# EAGLE design 536-counter-7seg (EAGLE 7.5.0)
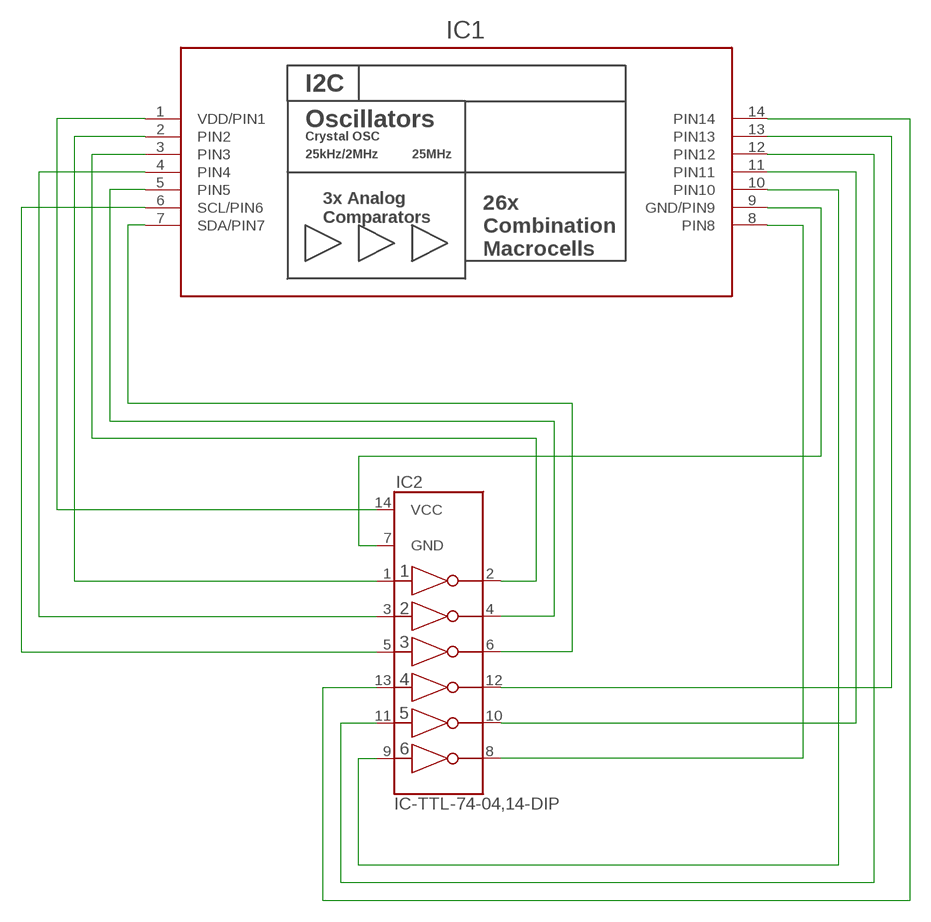
[diagram p0: schematic, sheet 1]

## Parts
IC1  SLG46536V  [STQFN14-0.4P2.0X2.2]
IC2  IC-TTL-74-04,14-DIP  [IC-SOCKET-DIL-14]

## Nets
GND: IC1.9(GND/PIN9) IC2.7(GND)
N$1: IC1.1(VDD/PIN1) IC2.14(VCC)
N$3: IC1.2(PIN2) IC2.1(1A)
N$4: IC1.3(PIN3) IC2.2(1Y)
N$5: IC1.4(PIN4) IC2.3(2A)
N$6: IC1.5(PIN5) IC2.4(2Y)
N$7: IC1.6(SCL/PIN6) IC2.5(3A)
N$8: IC1.7(SDA/PIN7) IC2.6(3Y)
N$9: IC1.8(PIN8) IC2.8(6Y)
N$10: IC1.10(PIN10) IC2.9(6A)
N$11: IC1.11(PIN11) IC2.10(5Y)
N$12: IC1.12(PIN12) IC2.11(5A)
N$13: IC1.13(PIN13) IC2.12(4Y)
N$14: IC1.14(PIN14) IC2.13(4A)

## Library data of the parts
IC1 = mylib:SLG46536
IC2 = mylib:IC-TTL-74-04,14: IC-TTL-74-04,14 : HEX INVERTER Packages : -DIP : 2.54 x 14 x 300mil -FLAT : 1.27 x 14 x (Width) (Variant name3) : (Pitch) x (Pin) x (Width)

## Board
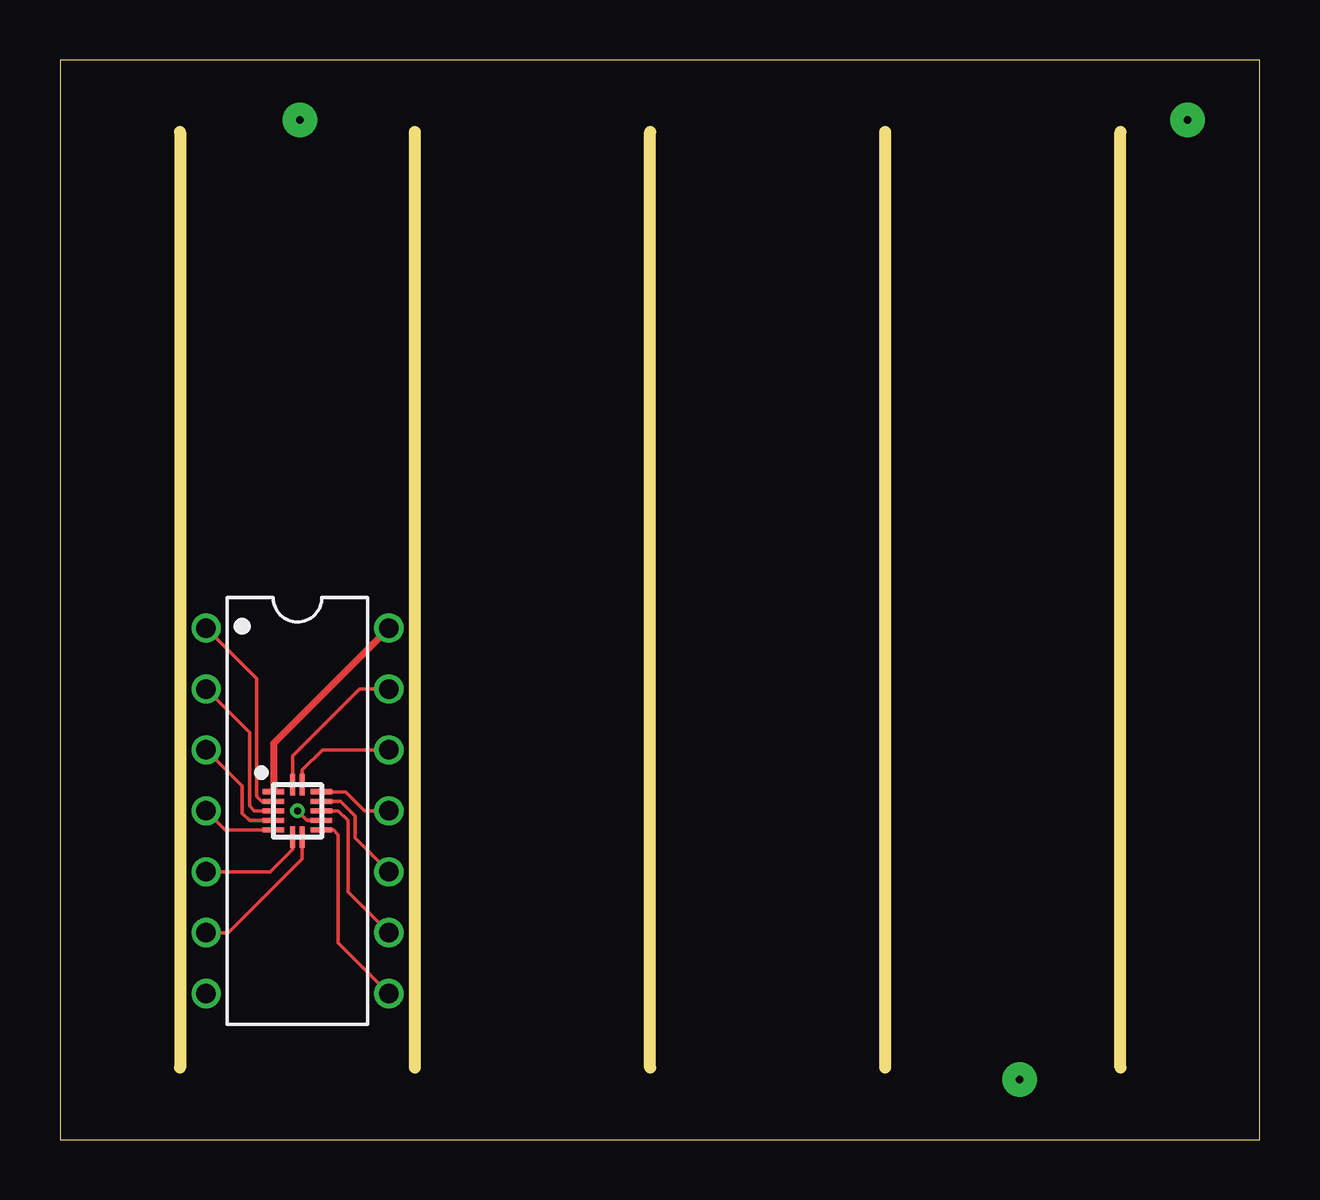
[diagram p1: board, top side]
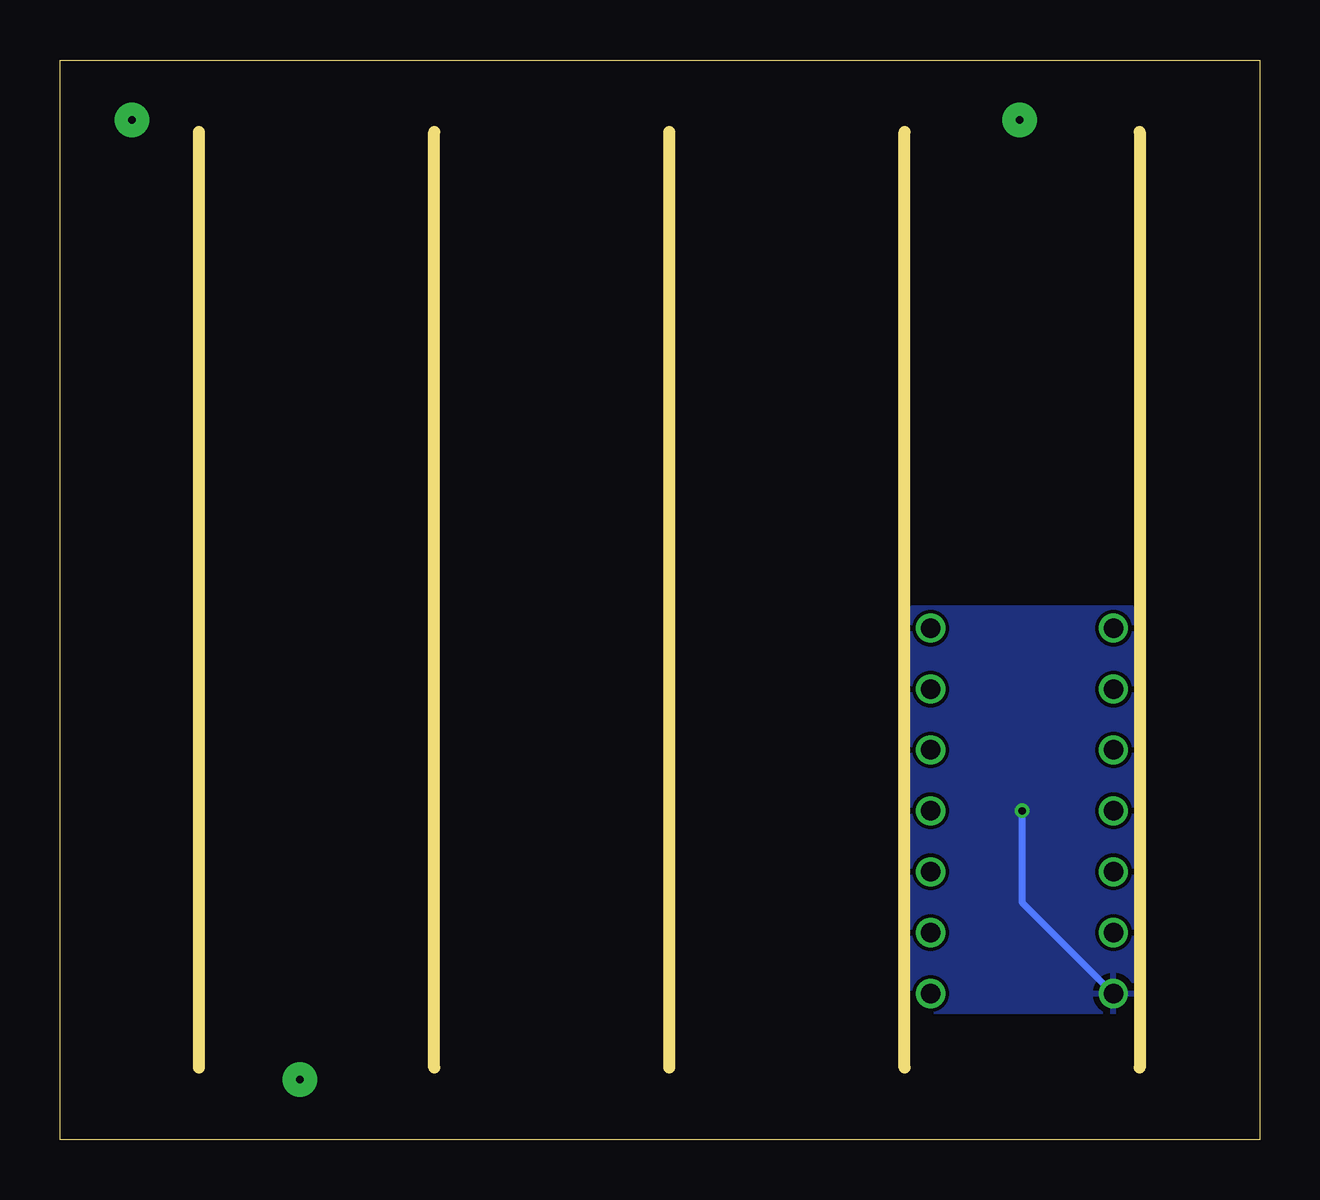
[diagram p2: board, bottom side, seen from below]

Size 50 x 45 mm. Coordinates in mm from the lower left corner, seen from the top.
Outline: 0,0 50,0 50,45 0,45 0,0
Copper layers (1*16): Top 0.035mm / dielectric 1.5mm / Bottom 0.035mm
Design rules "default *": minimum track width 0.15mm, minimum drill 0.3mm, track to track 0.15mm, track to pad 0.15mm, pad to pad 0.15mm, via to via 0.15mm, smd to smd 0.15mm, copper to edge 0.15mm, drill to drill 0.15mm, minimum pad ring 0.15mm, minimum via ring 0.15mm, stop-mask expansion 4mil, vias tented up to drill 0mil, thermal gap 10mil
Milling: 5 lines

### Footprints (pad centres in the part's own frame; a part is rotated, then mirrored left to right if it is on the bottom)
STQFN14-0.4P2.0X2.2 = smd 0.9 x 0.21: 1 -1,0.8; 2 -1,0.4; 3 -1,0; 4 -1,-0.4; 5 -1,-0.8; 8 1,-0.8; 9 1,-0.4; 10 1,0; 11 1,0.4; 12 1,0.8 | smd 0.21 x 0.9: 6 -0.2,-1.1; 7 0.2,-1.1; 13 0.2,1.1; 14 -0.2,1.1
IC-SOCKET-DIL-14 = drill 0.813: 1 -7.62,-3.81; 2 -5.08,-3.81; 3 -2.54,-3.81; 4 0,-3.81; 5 2.54,-3.81; 6 5.08,-3.81; 7 7.62,-3.81; 8 7.62,3.81; 9 5.08,3.81; 10 2.54,3.81; 11 0,3.81; 12 -2.54,3.81; 13 -5.08,3.81; 14 -7.62,3.81

### Placement (x,y rotation side)
IC1  9.9,13.7 0 top
IC2  9.9,13.7 270 top

### Tracks (layer width: path | path; a pad name or v marks a point on that pad's centre or on a via)
GND  (via drill 0.3)
  Top 0.15: IC1.9 10.3,13.3 v9.9,13.7
  Bottom 0.3: v9.9,13.7 9.9,9.89 IC2.7
  pour Bottom: 5.3,22.2 14.5,22.2 14.5,5.3 5.3,5.3
N$1
  Top 0.15: 8.9,14.6 IC1.1
  Top 0.3: 8.9,14.6 8.9,16.51 IC2.14
N$2  (via drill 0.3 pad 1.42)
  other vias: 10,42.5
N$3
  Top 0.15: IC2.1 8.2,19.21 8.2,14.3 8.4,14.1 IC1.2
N$4
  Top 0.15: IC2.2 7.9,16.97 7.9,13.9 8.1,13.7 IC1.3
N$5
  Top 0.15: IC2.3 7.6,14.73 7.6,13.6 7.9,13.3 IC1.4
N$6
  Top 0.15: IC2.4 6.89,12.9 IC1.5
N$7
  Top 0.15: IC1.6 9.7,12.1 8.76,11.16 IC2.5
N$8
  Top 0.15: IC1.7 10.1,11.7 7.02,8.62 IC2.6
N$9
  Top 0.15: IC1.8 11.4,12.9 11.6,12.7 11.6,8.19 IC2.8
N$10
  Top 0.15: IC1.10 11.6,13.7 12,13.3 12,10.33 IC2.9
N$11
  Top 0.15: IC1.11 11.7,14.1 12.3,13.5 12.3,12.57 IC2.10
N$12
  Top 0.15: IC1.12 11.9,14.5 12.7,13.7 IC2.11
N$13
  Top 0.15: IC1.13 10.1,15.4 10.94,16.24 IC2.12
N$14
  Top 0.15: IC2.13 12.48,18.78 9.7,16 IC1.14
N$15  (via drill 0.3 pad 1.42)
  other vias: 47,42.5
N$16  (via drill 0.3 pad 1.42)
  other vias: 40,2.5

### Text on the board
Vscore: v-cut -> | v-cut -> | v-cut ->